# EAGLE design untitled (EAGLE 5.11)
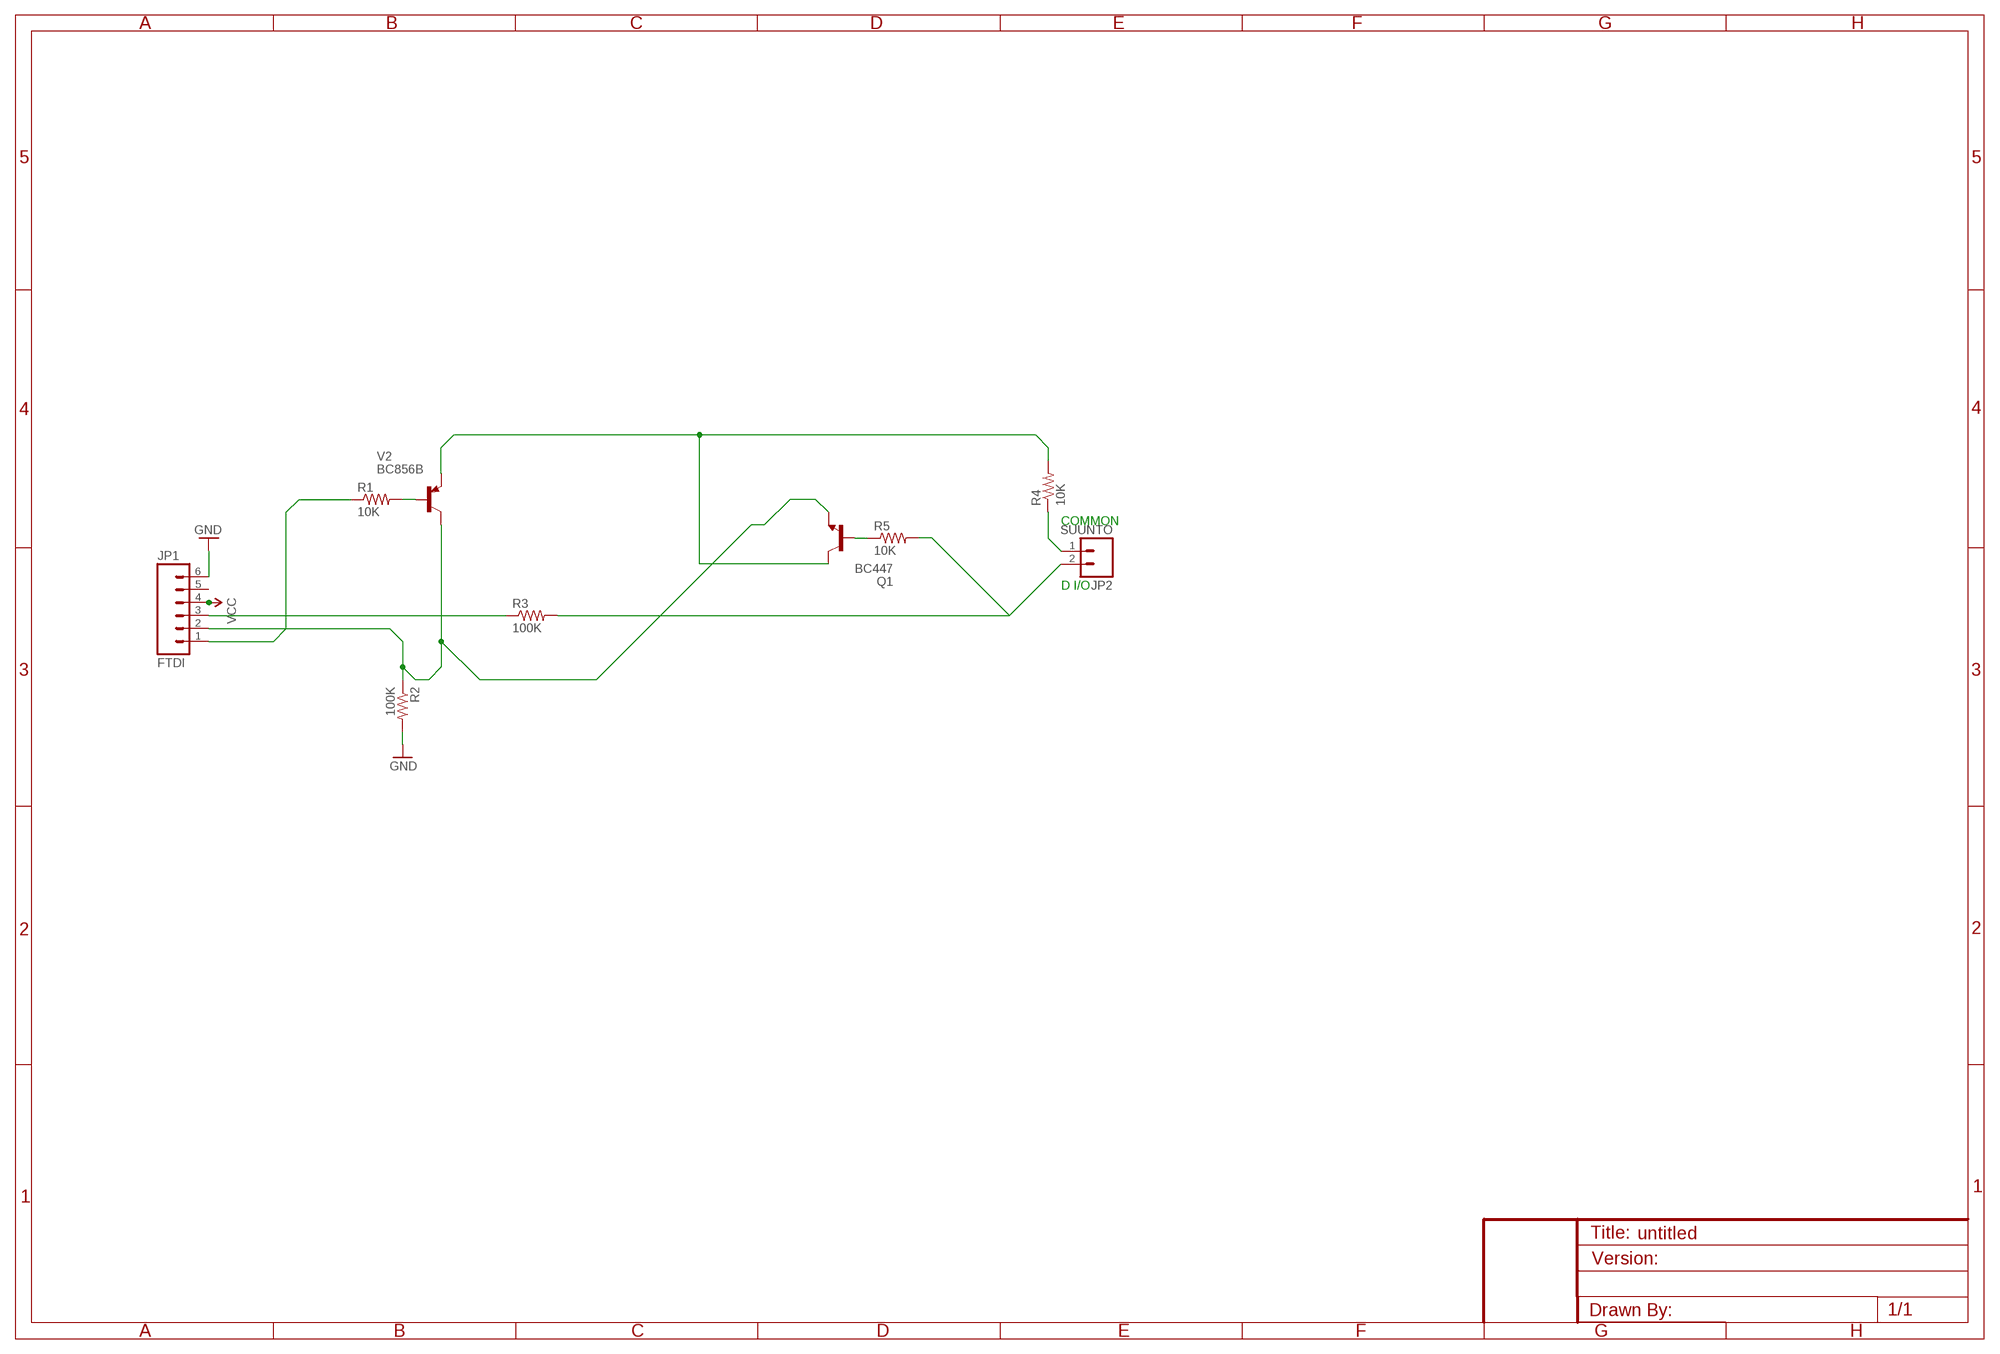
[diagram p0: schematic, sheet 1]

## Parts
JP1  FTDI  M06LOCK_LONGPADS  [1X06_LOCK_LONGPADS]
JP2  SUUNTO  M02  [1X02_LONGPADS]
Q1  BC447  [TO92-EBC]
R1  10K  RESISTORPTH1  [AXIAL-0.3]
R2  100K  RESISTORPTH1  [AXIAL-0.3]
R3  100K  RESISTORPTH1  [AXIAL-0.3]
R4  10K  RESISTORPTH1  [AXIAL-0.3]
R5  10K  RESISTORPTH1  [AXIAL-0.3]
V2  BC856B  BC556  [TO92-EBC]

## Nets
GND: JP1.6 R2.P$2
N$1: JP1.1 R1.P$1
N$2: R1.P$2 V2.B
N$3: Q1.B R5.P$1
N$4: Q1.C R4.P$2 V2.E
N$5: JP2.1 R4.P$1
N$6: JP1.2 Q1.E R2.P$1 V2.C
N$8: JP1.3 R3.P$1
N$9: JP2.2 R3.P$2 R5.P$2
VCC: JP1.4
Unconnected: JP1.5

## Notes on the sheet
- COMMON
- D I/O

## Library data of the parts
JP1 = SparkFun:M06: Header 6 Standard 6-pin 0.1" header. Use with straight break away headers (SKU : PRT-00116), right angle break away headers (PRT-00553), swiss pins (PRT-00743), machine pins (PRT-00117), and female headers (PRT-00115). Molex polarized connector foot print use with SKU : PRT-08094 with associated crimp pins and housings. NOTES ON THE VARIANTS LOCK and LOCK_LONGPADS... This footprint was designed to help hold the alignment of a through-hole component (i.e. 6-pin header) while soldering it into place. You may notice that each hole has been shifted either up or down by 0.005 of an inch from it's more standard position (which is a perfectly straight line). This slight alteration caused the pins (the squares in the middle) to touch the edges of the holes. Because they are alternating, it causes a "brace" to hold the component in place. 0.005 has proven to be the perfect amount of "off-center" position when using our standard breakaway headers. Although looks a little odd when you look at the bare footprint, once you have a header in there, the alteration is very hard to notice. Also, if you push a header all the way into place, it is covered up entirely on the bottom side. This idea of altering the position of holes to aid alignment will be further integrated into the Sparkfun Library for other footprints. It can help hold any component with 3 or more connection pins.
JP2 = SparkFun:M02: Header 2 Standard 2-pin 0.1" header. Use with straight break away headers (SKU : PRT-00116), right angle break away headers (PRT-00553), swiss pins (PRT-00743), machine pins (PRT-00117), and female headers (PRT-00115). Molex polarized connector foot print use with SKU : PRT-08233 with associated crimp pins and housings.
Q1 = transistor-npn:BC447*: NPN Transistor
R1-R5 = SparkFun:RESISTOR: Resistor Basic schematic elements and footprints for 0603, 1206, and PTH 1/10th watt (small) resistors.
V2 = transistor-pnp:BC556*: PNP Transistror

## Board
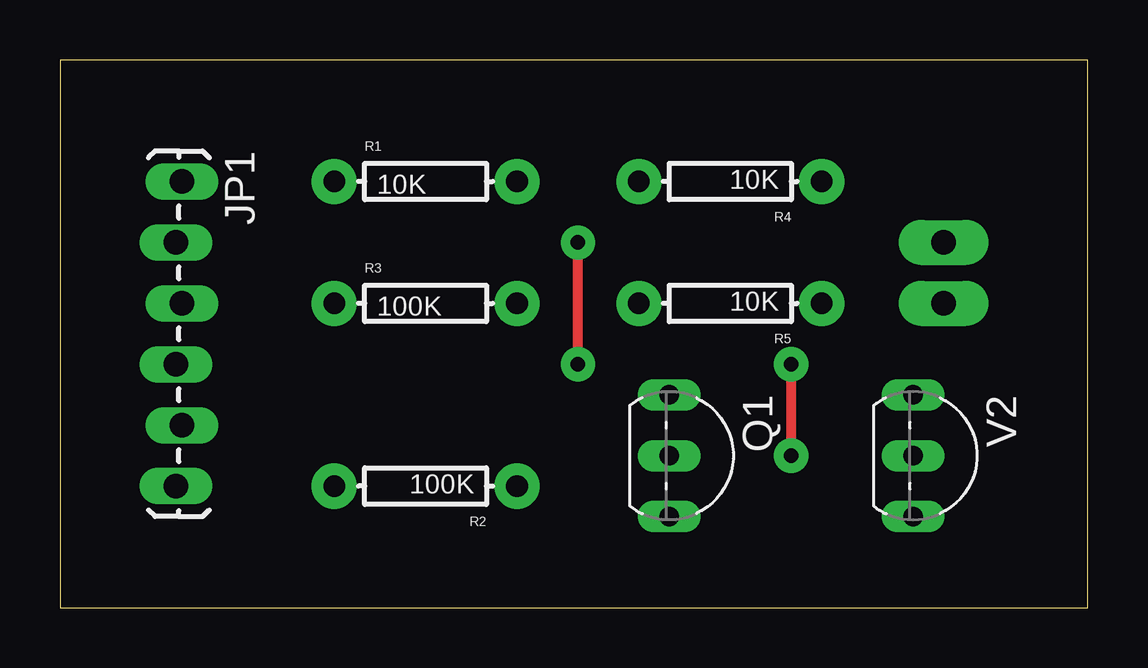
[diagram p1: board, top side]
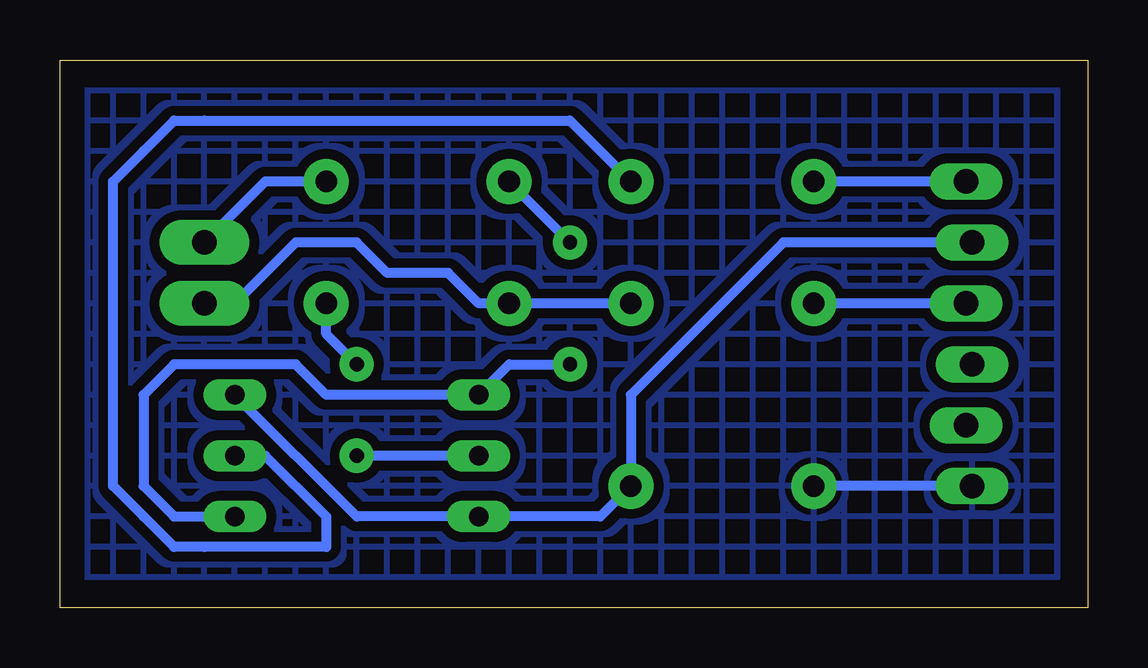
[diagram p2: board, bottom side, seen from below]

Size 42.85 x 22.85 mm. Coordinates in mm from the lower left corner, seen from the top.
Outline: 0,0 42.85,0 42.85,22.85 0,22.85 0,0
Copper layers (1*16): Top 0.035mm / dielectric 1.5mm / Bottom 0.035mm
Design rules "default": minimum track width 10mil, minimum drill 24mil, track to track 8mil, track to pad 8mil, pad to pad 8mil, via to via 8mil, smd to smd 8mil, copper to edge 40mil, drill to drill 8mil, minimum pad ring 10mil, minimum via ring 8mil, stop-mask expansion 4mil, vias tented up to drill 0mil, thermal gap 10mil

### Footprints (pad centres in the part's own frame; a part is rotated, then mirrored left to right if it is on the bottom)
1X06_LOCK_LONGPADS = drill 1.016 long: 1 0,0; 2 2.54,-0.254; 3 5.08,0; 4 7.62,-0.254; 5 10.16,0; 6 12.7,-0.254
1X02_LONGPADS = drill 1.016 pad 1.88 long: 1 0,0; 2 2.54,0
TO92-EBC = drill 0.813 long: B 0,-1.27; C -2.54,-1.27; E 2.54,-1.27
AXIAL-0.3 = drill 0.9 pad 1.88 round: P$1 -3.81,0; P$2 3.81,0

### Placement (x,y rotation side)
JP1  5.08,17.78 270 top
JP2  36.83,15.24 270 top
Q1  26.67,6.35 270 top
R1  15.24,17.78 0 top
R2  15.24,5.08 180 top
R3  15.24,12.7 0 top
R4  27.94,17.78 180 top
R5  27.94,12.7 180 top
V2  36.83,6.35 270 top

### Tracks (layer width: path | path; a pad name or v marks a point on that pad's centre or on a via)
GND
  Bottom 0.406: JP1.6 R2.P$2
  pour Bottom (isolate 0.406, hatched): 1.27,21.59 1.27,1.27 41.91,1.27 41.91,21.59
N$1
  Bottom 0.406: JP1.1 R1.P$1
N$2
  Bottom 0.406: R1.P$2 21.59,20.32 36.83,20.32 38.1,20.32 39.37,19.05 40.64,17.78 40.64,5.08 39.37,3.81 38.1,2.54 36.83,2.54 31.75,2.54 31.75,3.81 34.29,6.35 V2.B
N$3  (via drill 0.6 pad 1.42)
  Top 0.406: v30.48,6.35 v30.48,10.16
  Bottom 0.406: R5.P$1 31.75,11.43 v30.48,10.16 | Q1.B v30.48,6.35
N$4  (via drill 0.6 pad 1.42)
  Top 0.406: v21.59,10.16 v21.59,15.24
  Bottom 0.406: v21.59,15.24 R4.P$2 | v21.59,10.16 24.13,10.16 Q1.C 31.75,8.89 33.02,10.16 38.1,10.16 39.37,8.89 39.37,5.08 38.1,3.81 V2.E
N$5
  Bottom 0.406: R4.P$1 34.29,17.78 JP2.1
N$6
  Bottom 0.406: JP1.2 12.7,15.24 19.05,8.89 R2.P$1 20.32,3.81 Q1.E 30.48,3.81 V2.C
N$8
  Bottom 0.406: JP1.3 R3.P$1
N$9
  Bottom 0.406: R3.P$2 R5.P$2 25.4,12.7 26.67,13.97 29.21,13.97 30.48,15.24 33.02,15.24 35.56,12.7 JP2.2
N$13  (via drill 0.6 pad 1.42)
  other vias: 21.59,15.24
N$14  (via drill 0.6 pad 1.42)
  other vias: 21.59,10.16
N$15  (via drill 0.6 pad 1.42)
  other vias: 30.48,6.35
N$16  (via drill 0.6 pad 1.42)
  other vias: 30.48,10.16